# EAGLE design serial (EAGLE 5.10)
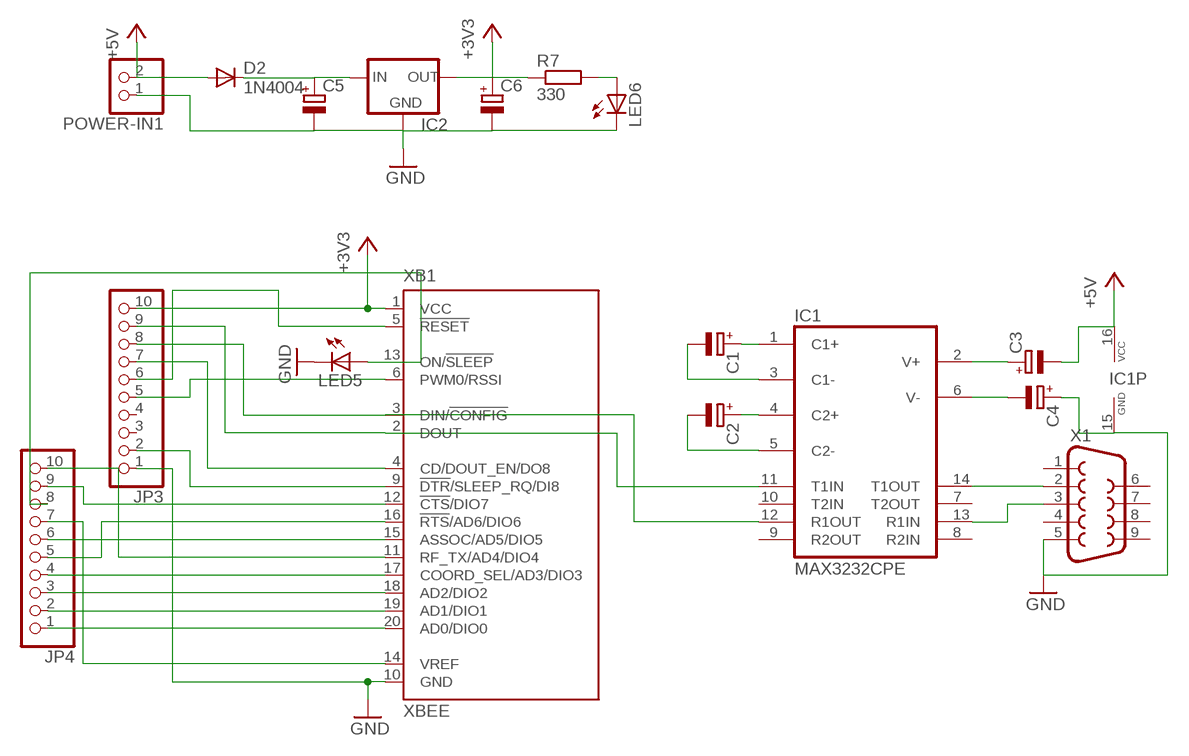
[diagram p0: schematic, sheet 1]

## Parts
C1  CPOL-EUE2,5-6E  [E2,5-6E]
C2  CPOL-EUE2,5-6E  [E2,5-6E]
C3  CPOL-EUE2,5-6E  [E2,5-6E]
C4  CPOL-EUE2,5-6E  [E2,5-6E]
C5  CPOL-EUE2.5-7  [E2,5-7]
C6  CPOL-EUE2.5-7  [E2,5-7]
D2  1N4004  [DO41-10]
IC1  MAX3232CPE  [DIL16]
IC2  78LXX  [78LXX]
JP3  PINHD-1X10  [1X10]
JP4  PINHD-1X10  [1X10]
LED5  LED5MM  [LED5MM]
LED6  LED5MM  [LED5MM]
POWER-IN1  PINHD-1X2  [1X02]
R7  330  R-EU_0207/10  [0207/10]
X1  F09H  [F09H]
XB1  XBEE  [XBEE]

## Nets
+3V3: C6.+ IC2.OUT JP3.10 R7.1 XB1.1(VCC)
+5V: C3.- D2.A IC1.16(VCC) POWER-IN1.2
GND: C4.+ C5.- C6.- IC1.15(GND) IC2.GND JP3.1 LED5.K(C) LED6.K(C) POWER-IN1.1 X1.5 XB1.10(GND)
N$1: IC1.14(T1OUT) X1.2
N$2: IC1.13(R1IN) X1.3
N$3: JP3.7 XB1.4(CD/DOUT_EN/DO8)
N$4: JP3.6 XB1.5(!RESET)
N$5: C4.- IC1.6(V-)
N$6: C3.+ IC1.2(V+)
N$7: C2.+ IC1.4(C2+)
N$8: C1.- IC1.3(C1-)
N$9: C1.+ IC1.1(C1+)
N$10: IC1.11(T1IN) JP3.9 XB1.2(DOUT)
N$11: JP4.8 LED5.A XB1.13(ON/!SLEEP)
N$12: C5.+ D2.C IC2.IN
N$13: C2.- IC1.5(C2-)
N$14: JP3.5 XB1.6(PWM0/RSSI)
N$15: JP3.2 XB1.9(!DTR!/SLEEP_RQ/DI8)
N$16: JP4.7 XB1.14(VREF)
N$17: JP4.10 XB1.11(RF_TX/AD4/DIO4)
N$18: JP4.9 XB1.12(!CTS!/DIO7)
N$19: JP4.6 XB1.15(ASSOC/AD5/DIO5)
N$20: JP4.5 XB1.16(!RTS!/AD6/DIO6)
N$21: JP4.4 XB1.17(COORD_SEL/AD3/DIO3)
N$22: JP4.3 XB1.18(AD2/DIO2)
N$23: JP4.2 XB1.19(AD1/DIO1)
N$24: JP4.1 XB1.20(AD0/DIO0)
N$29: IC1.12(R1OUT) JP3.8 XB1.3(DIN/!CONFIG)
N$42: LED6.A R7.2
Unconnected: IC1.7(T2OUT) IC1.8(R2IN) IC1.9(R2OUT) IC1.10(T2IN) JP3.3 JP3.4 X1.1 X1.4 X1.6 X1.7 X1.8 X1.9

## Library data of the parts
C1-C6 = rcl:CPOL-EU: POLARIZED CAPACITOR, European symbol
D2 = diode:1N4004: DIODE general purpose rectifier, 1 A
IC1 = maxim:MAX3232*: True RS-232 Transceivers 3.0V to 5.5V, Low-Power up to 1Mbps, Using Four 0.1µF External Capacitors Source: http://pdfserv.maxim-ic.com/en/ds/MAX3222-MAX3241.pdf
IC2 = v-reg:78LXX: VOLTAGE REGULATOR
JP3 JP4 = pinhead:PINHD-1X10: PIN HEADER
LED5 LED6 = led:LED: LED OSRAM: - CHIPLED LG R971, LG N971, LY N971, LG Q971, LY Q971, LO R971, LY R971 LH N974, LH R974 LS Q976, LO Q976, LY Q976 LO Q996 - Hyper CHIPLED LW Q18S LB Q993, LB Q99A, LB R99A - SideLED LS A670, LO A670, LY A670, LG A670, LP A670 LB A673, LV A673, LT A673, LW A673 LH A674 LY A675 LS A676, LA A676, LO A676, LY A676, LW A676 LS A679, LY A679, LG A679 - Hyper Micro SIDELED® LS Y876, LA Y876, LO Y876, LY Y876 LT Y87S - SmartLED LW L88C, LW L88S LB L89C, LB L89S, LG L890 LS L89K, LO L89K, LY L89K LS L896, LA L896, LO L896, LY L896 - TOPLED LS T670, LO T670, LY T670, LG T670, LP T670 LSG T670, LSP T670, LSY T670, LOP T670, LYG T670 LG T671, LOG T671, LSG T671 LB T673, LV T673, LT T673, LW T673 LH T674 LS T676, LA T676, LO T676, LY T676, LB T676, LH T676, LSB T676, LW T676 LB T67C, LV T67C, LT T67C, LS T67K, LO T67K, LY T67K, LW E67C LS E67B, LA E67B, LO E67B, LY E67B, LB E67C, LV E67C, LT E67C LW T67C LS T679, LY T679, LG T679 LS T770, LO T770, LY T770, LG T770, LP T770 LB T773, LV T773, LT T773, LW T773 LH T774 LS E675, LA E675, LY E675, LS T675 LS T776, LA T776, LO T776, LY T776, LB T776 LHGB T686 LT T68C, LB T68C - Hyper Mini TOPLED® LB M676 - Mini TOPLED Santana® LG M470 LS M47K, LO M47K, LY M47K Source: http://www.osram.convergy.de LUXEON: - LUMILED® LXK2-PW12-R00, LXK2-PW12-S00, LXK2-PW14-U00, LXK2-PW14-V00 LXK2-PM12-R00, LXK2-PM12-S00, LXK2-PM14-U00 LXK2-PE12-Q00, LXK2-PE12-R00, LXK2-PE12-S00, LXK2-PE14-T00, LXK2-PE14-U00 LXK2-PB12-K00, LXK2-PB12-L00, LXK2-PB12-M00, LXK2-PB14-N00, LXK2-PB14-P00, LXK2-PB14-Q00 LXK2-PR12-L00, LXK2-PR12-M00, LXK2-PR14-Q00, LXK2-PR14-R00 LXK2-PD12-Q00, LXK2-PD12-R00, LXK2-PD12-S00 LXK2-PH12-R00, LXK2-PH12-S00 LXK2-PL12-P00, LXK2-PL12-Q00, LXK2-PL12-R00 Source: www.luxeon.com KINGBRIGHT: KA-3528ASYC Source: www.kingbright.com
POWER-IN1 = pinhead:PINHD-1X2: PIN HEADER
R7 = rcl:R-EU_: RESISTOR, European symbol
X1 = con-subd:F09: SUB-D
XB1 = maxstream:XBEE: XBee (TM) /XBee-PRO(TM) OEM RF Modules Source: MaxStream, Inc. xbee_productmanual.pdf

## Board
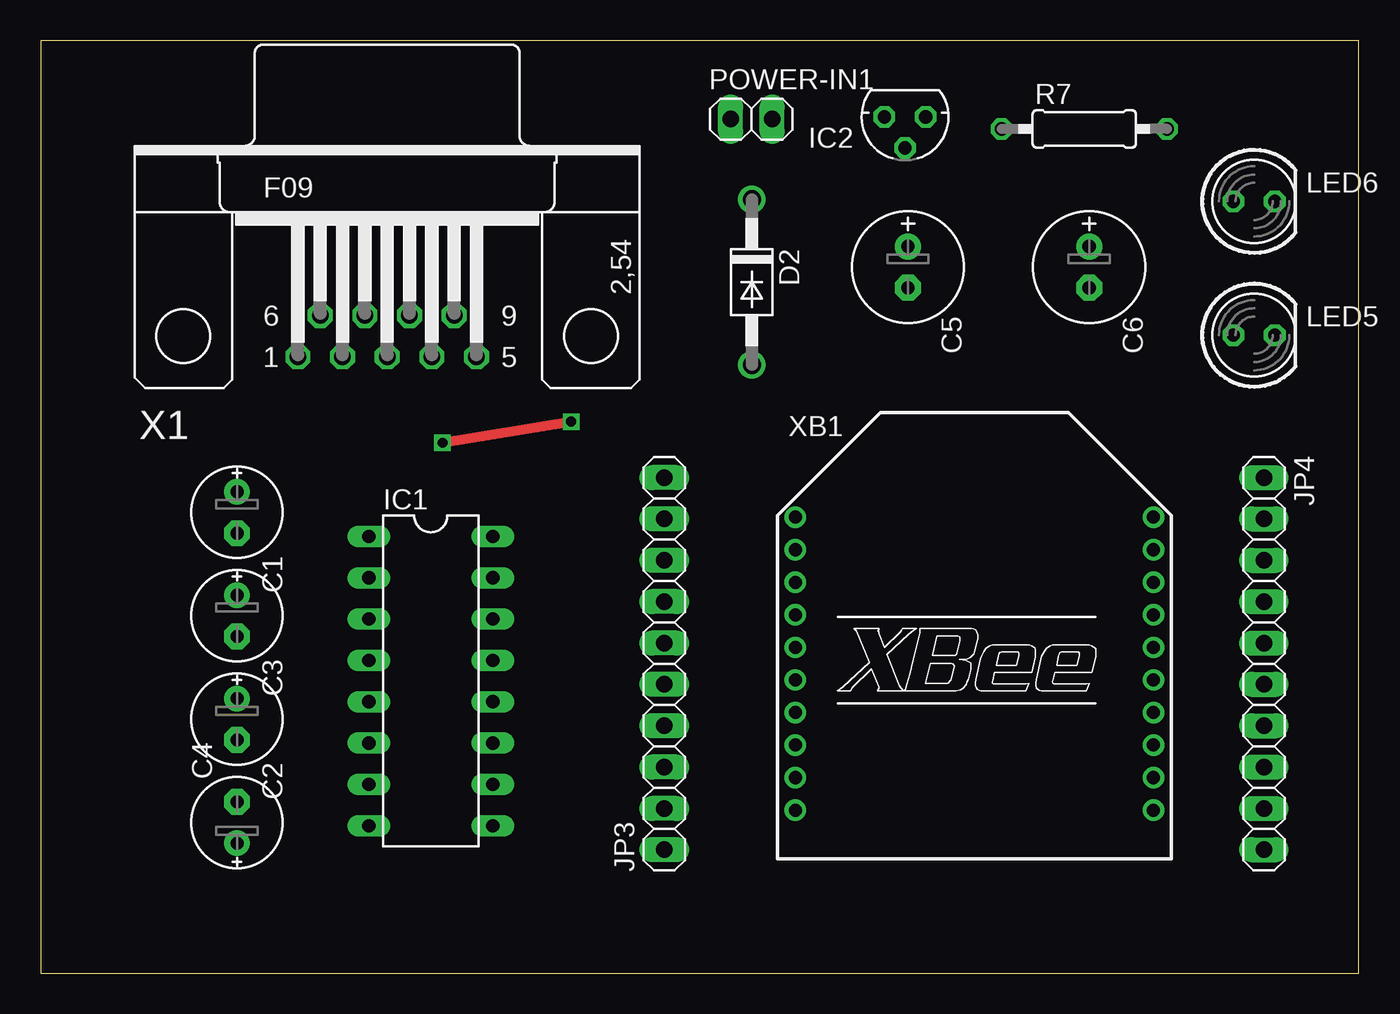
[diagram p1: board, top side]
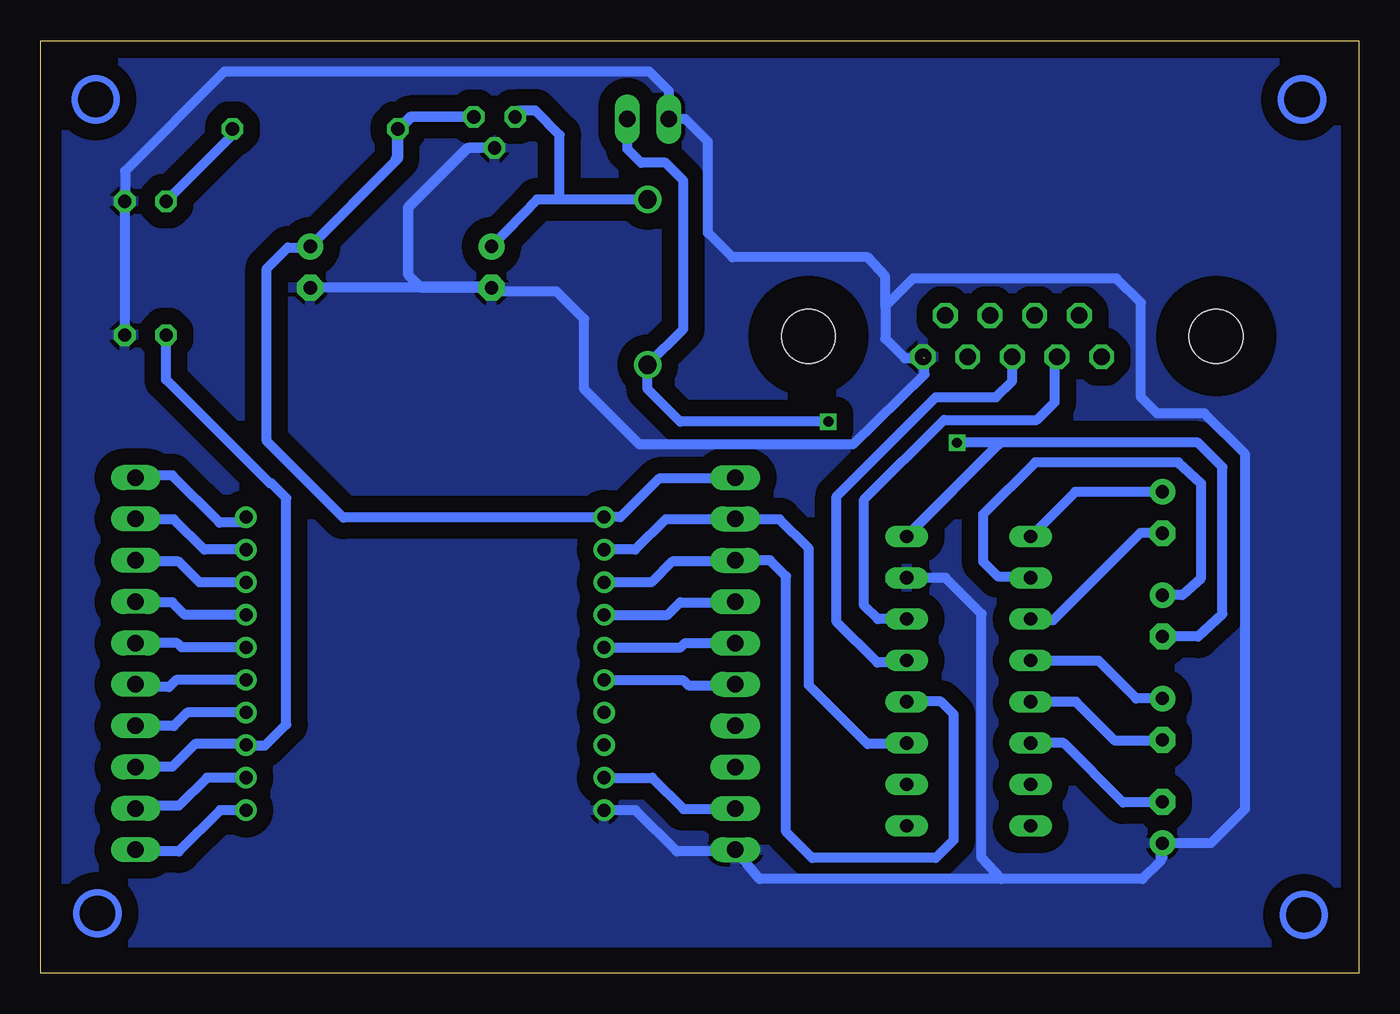
[diagram p2: board, bottom side, seen from below]

Size 80.96 x 57.29 mm. Coordinates in mm from the lower left corner, seen from the top.
Outline: 0,0 80.96,0 80.96,57.29 0,57.29 0,0
Copper layers (1*16): Top 0.035mm / dielectric 1.5mm / Bottom 0.035mm
Design rules "default": minimum track width 10mil, minimum drill 24mil, track to track 8mil, track to pad 8mil, pad to pad 8mil, via to via 8mil, smd to smd 8mil, copper to edge 40mil, drill to drill 8mil, minimum pad ring 10mil, minimum via ring 8mil, stop-mask expansion 4mil, vias tented up to drill 0mil, thermal gap 10mil

### Footprints (pad centres in the part's own frame; a part is rotated, then mirrored left to right if it is on the bottom)
E2,5-6E = drill 0.813 pad 1.575 round: + -1.27,0 | drill 0.813 pad 1.575 octagon: - 1.27,0
E2,5-7 = drill 0.813 pad 1.6 round: + -1.27,0 | drill 0.813 pad 1.6 octagon: - 1.27,0
DO41-10 = drill 1.118 round: A 5.08,0; C -5.08,0
DIL16 = drill 0.813 long: 1 -8.89,-3.81; 2 -6.35,-3.81; 3 -3.81,-3.81; 4 -1.27,-3.81; 5 1.27,-3.81; 6 3.81,-3.81; 7 6.35,-3.81; 8 8.89,-3.81; 9 8.89,3.81; 10 6.35,3.81; 11 3.81,3.81; 12 1.27,3.81; 13 -1.27,3.81; 14 -3.81,3.81; 15 -6.35,3.81; 16 -8.89,3.81
78LXX = drill 0.813 octagon: GND 0,1.905; IN 1.27,0; OUT -1.27,0
1X10 = drill 1.016 long: 1 -11.43,0; 2 -8.89,0; 3 -6.35,0; 4 -3.81,0; 5 -1.27,0; 6 1.27,0; 7 3.81,0; 8 6.35,0; 9 8.89,0; 10 11.43,0
LED5MM = drill 0.813 octagon: A -1.27,0; K 1.27,0
1X02 = drill 1.016 long: 1 -1.27,0; 2 1.27,0
0207/10 = drill 0.813 octagon: 1 -5.08,0; 2 5.08,0
F09H = drill 1.016 octagon: 1 -5.486,-1.27; 2 -2.743,-1.27; 3 0,-1.27; 4 2.743,-1.27; 5 5.486,-1.27; 6 -4.115,1.27; 7 -1.372,1.27; 8 1.372,1.27; 9 4.115,1.27 | hole 3.302: -12.522,0; 12.522,0
XBEE = drill 0.8 pad 1.27 round: 1 -11,9; 2 -11,7; 3 -11,5; 4 -11,3; 5 -11,1; 6 -11,-1; 7 -11,-3; 8 -11,-5; 9 -11,-7; 10 -11,-9; 11 11,-9; 12 11,-7; 13 11,-5; 14 11,-3; 15 11,-1; 16 11,1; 17 11,3; 18 11,5; 19 11,7; 20 11,9

### Placement (x,y rotation side)
C1  12.06,28.31 270 top
C2  12.06,15.61 270 top
C3  12.06,21.96 270 top
C4  12.06,9.26 90 top
C5  53.27,43.38 270 top
C6  64.4,43.38 270 top
D2  43.68,42.46 270 top
IC1  23.96,17.95 270 top
IC2  53.09,52.61 180 top
JP3  38.3,19.02 90 top
JP4  75.13,19.02 270 top
LED5  74.53,39.2 0 top
LED6  74.53,47.42 0 top
POWER-IN1  43.65,52.47 0 top
R7  64.1,51.87 0 top
X1  21.28,39.14 0 top
XB1  57.35,19.02 0 top

### Tracks (layer width: path | path; a pad name or v marks a point on that pad's centre or on a via)
+3V3
  Bottom 0.61: C6.+ 59.02,50.03 R7.1 58.28,52.61 IC2.OUT 58.16,52.61 59.08,51.69 59.08,50.09 59.18,49.99 59.18,49.89 64.48,44.59 65.78,44.59 67.08,43.29 67.08,32.69 62.38,27.99 46.38,27.99 XB1.1 45.35,28.02 42.98,30.39 38.36,30.39 JP3.10
+5V  (via drill 0.6)
  Top 0.61: v24.68,32.59 v32.58,33.89
  Bottom 0.61: C3.- 9.88,20.69 8.38,22.09 8.38,31.09 9.88,32.59 21.98,32.59 | 21.98,32.59 22.02,32.59 | 22.02,32.59 IC1.16 27.77,26.9 22.18,32.49 22.08,32.49 21.98,32.59 | 22.02,32.59 v24.68,32.59 | POWER-IN1.2 44.92,50.63 44.08,49.79 42.58,49.79 41.48,48.69 41.48,39.58 D2.A 43.68,35.89 41.68,33.89 v32.58,33.89
GND  (1 unrouted)
  Bottom 0.61: C4.+ 12.06,7.11 12.18,6.89 | 21.98,5.79 13.28,5.79 12.18,6.89 | 12.18,6.89 12.18,7.79 11.98,7.99 9.08,7.99 6.98,10.09 6.98,31.89 9.48,34.39 12.38,34.39 13.38,35.39 13.38,41.19 14.88,42.69 27.38,42.69 29.08,40.99 | X1.5 26.85,37.79 27.88,37.79 29.08,38.99 29.08,40.99 | IC1.15 25.39,24.3 23.18,22.09 23.18,7.09 21.98,5.79 | 29.08,40.99 29.08,42.79 30.18,43.99 38.48,43.99 39.98,45.49 39.98,51.09 41.36,52.47 POWER-IN1.1 42.38,54.19 43.58,55.39 69.68,55.39 75.78,49.29 75.78,47.44 LED6.K LED5.K | 57.58,42.11 C5.- | 57.58,42.11 C6.- | 57.58,42.11 58.38,42.91 58.38,46.99 54.67,50.7 IC2.GND 54.77,50.7 58.38,47.09 58.38,42.89 57.68,42.19 53.48,42.19 53.18,41.89 49.28,41.89 47.58,40.19 47.58,35.89 44.18,32.49 31.08,32.49 26.68,36.79 26.68,37.79 27.38,37.79 | 21.98,5.79 36.8,5.79 JP3.1 38.4,7.49 41.88,7.49 44.41,10.02 XB1.10
  pour Bottom (isolate 1.016): 1.48,55.99 79.38,55.99 79.38,1.89 1.38,1.89 1.38,56.09
N$1
  Bottom 0.61: IC1.14 29.55,21.76 30.38,22.59 30.38,29.09 25.48,33.99 19.78,33.99 18.68,35.09 18.68,37.73 X1.2
N$2
  Bottom 0.61: X1.3 21.28,36.39 22.28,35.39 25.98,35.39 32.08,29.29 32.08,21.59 29.58,19.09 27.9,19.09 IC1.13
N$3
  Bottom 0.61: XB1.4 42.45,22.02 41.68,22.79 38.34,22.79 JP3.7
N$4
  Bottom 0.61: XB1.5 41.65,20.02 41.38,20.29 JP3.6
N$5
  Bottom 0.61: IC1.6 18.13,14.14 14.48,10.49 12.1,10.49 C4.-
N$6
  Bottom 0.61: C3.+ 10.84,23.23 9.68,24.29 9.68,30.09 11.08,31.39 19.88,31.39 23.08,28.19 23.08,25.29 22.18,24.39 20.24,24.39 IC1.2
N$7
  Bottom 0.61: C2.+ 13.67,16.88 15.98,19.19 20.12,19.19 IC1.4
N$8
  Bottom 0.61: C1.- 13.43,27.04 18.78,21.69 20.08,21.69 IC1.3
N$9
  Bottom 0.61: C1.+ 17.41,29.58 IC1.1
N$10
  Bottom 0.61: XB1.2 44.45,26.02 42.58,27.89 38.92,27.89 | 38.92,27.89 JP3.9 | 38.92,27.89 35.58,27.89 33.78,26.09 33.78,17.69 30.18,14.09 27.82,14.09 IC1.11
N$11
  Bottom 0.61: LED5.A 73.26,36.47 66.88,30.09 66.78,30.09 65.88,29.19 65.88,15.29 67.18,13.99 68.32,13.99 XB1.13 68.42,14.09 71.48,14.09 72.88,12.69 75.11,12.69 JP4.8
N$12
  Bottom 0.61: D2.C 48.98,47.54 | 48.98,47.54 50.48,47.54 C5.+ | IC2.IN 51.82,52.75 51.58,52.99 50.58,52.99 49.08,51.49 49.08,47.64 48.98,47.54
N$13
  Bottom 0.61: IC1.5 17.37,16.68 14.98,14.29 12.11,14.29 C2.-
N$14
  Bottom 0.61: XB1.6 41.51,18.02 41.18,17.69 38.36,17.69 JP3.5
N$15
  Bottom 0.61: XB1.9 43.41,12.02 41.48,10.09 38.34,10.09 JP3.2
N$16
  Bottom 0.61: XB1.14 71.95,16.02 72.78,15.19 75.11,15.19 JP4.7
N$17
  Bottom 0.61: XB1.11 69.95,10.02 72.48,7.49 75.03,7.49 JP4.10
N$18
  Bottom 0.61: XB1.12 70.75,12.02 72.48,10.29 74.97,10.29 JP4.9
N$19
  Bottom 0.61: XB1.15 72.65,18.02 73.08,17.59 74.97,17.59 JP4.6
N$20
  Bottom 0.61: XB1.16 72.31,20.02 72.58,20.29 JP4.5
N$21
  Bottom 0.61: XB1.17 72.11,22.02 72.88,22.79 75.09,22.79 JP4.4
N$22
  Bottom 0.61: XB1.18 71.21,24.02 72.48,25.29 75.05,25.29 JP4.3
N$23
  Bottom 0.61: XB1.19 70.91,26.02 72.78,27.89 75.11,27.89 JP4.2
N$24
  Bottom 0.61: XB1.20 68.58,28.02 68.58,27.69 69.98,27.69 72.88,30.59 74.99,30.59 JP4.1
N$29
  Bottom 0.61: XB1.3 43.45,24.02 42.18,25.29 38.38,25.29 JP3.8 36.16,25.37 35.18,24.39 35.18,8.69 33.58,7.09 25.98,7.09 24.88,8.19 24.88,15.89 25.68,16.69 IC1.12
N$42
  Bottom 0.61: R7.2 68.98,51.7 LED6.A
(copper drawn outside any net)
  shapes: Bottom circle x4